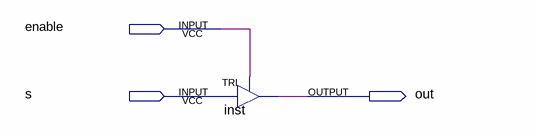
[diagram p0: schematic sheet]
// Quartus schematic three_state_gate_logic.bdf as structural Verilog: 1 symbols, 3 pins
module three_state_gate_logic (
  input  enable,
  input  s,
  output out
);

  TRI inst (.IN(s), .OE(enable), .OUT(out));
endmodule
